# EAGLE schematic detect-UHF (EAGLE 9.2.2)
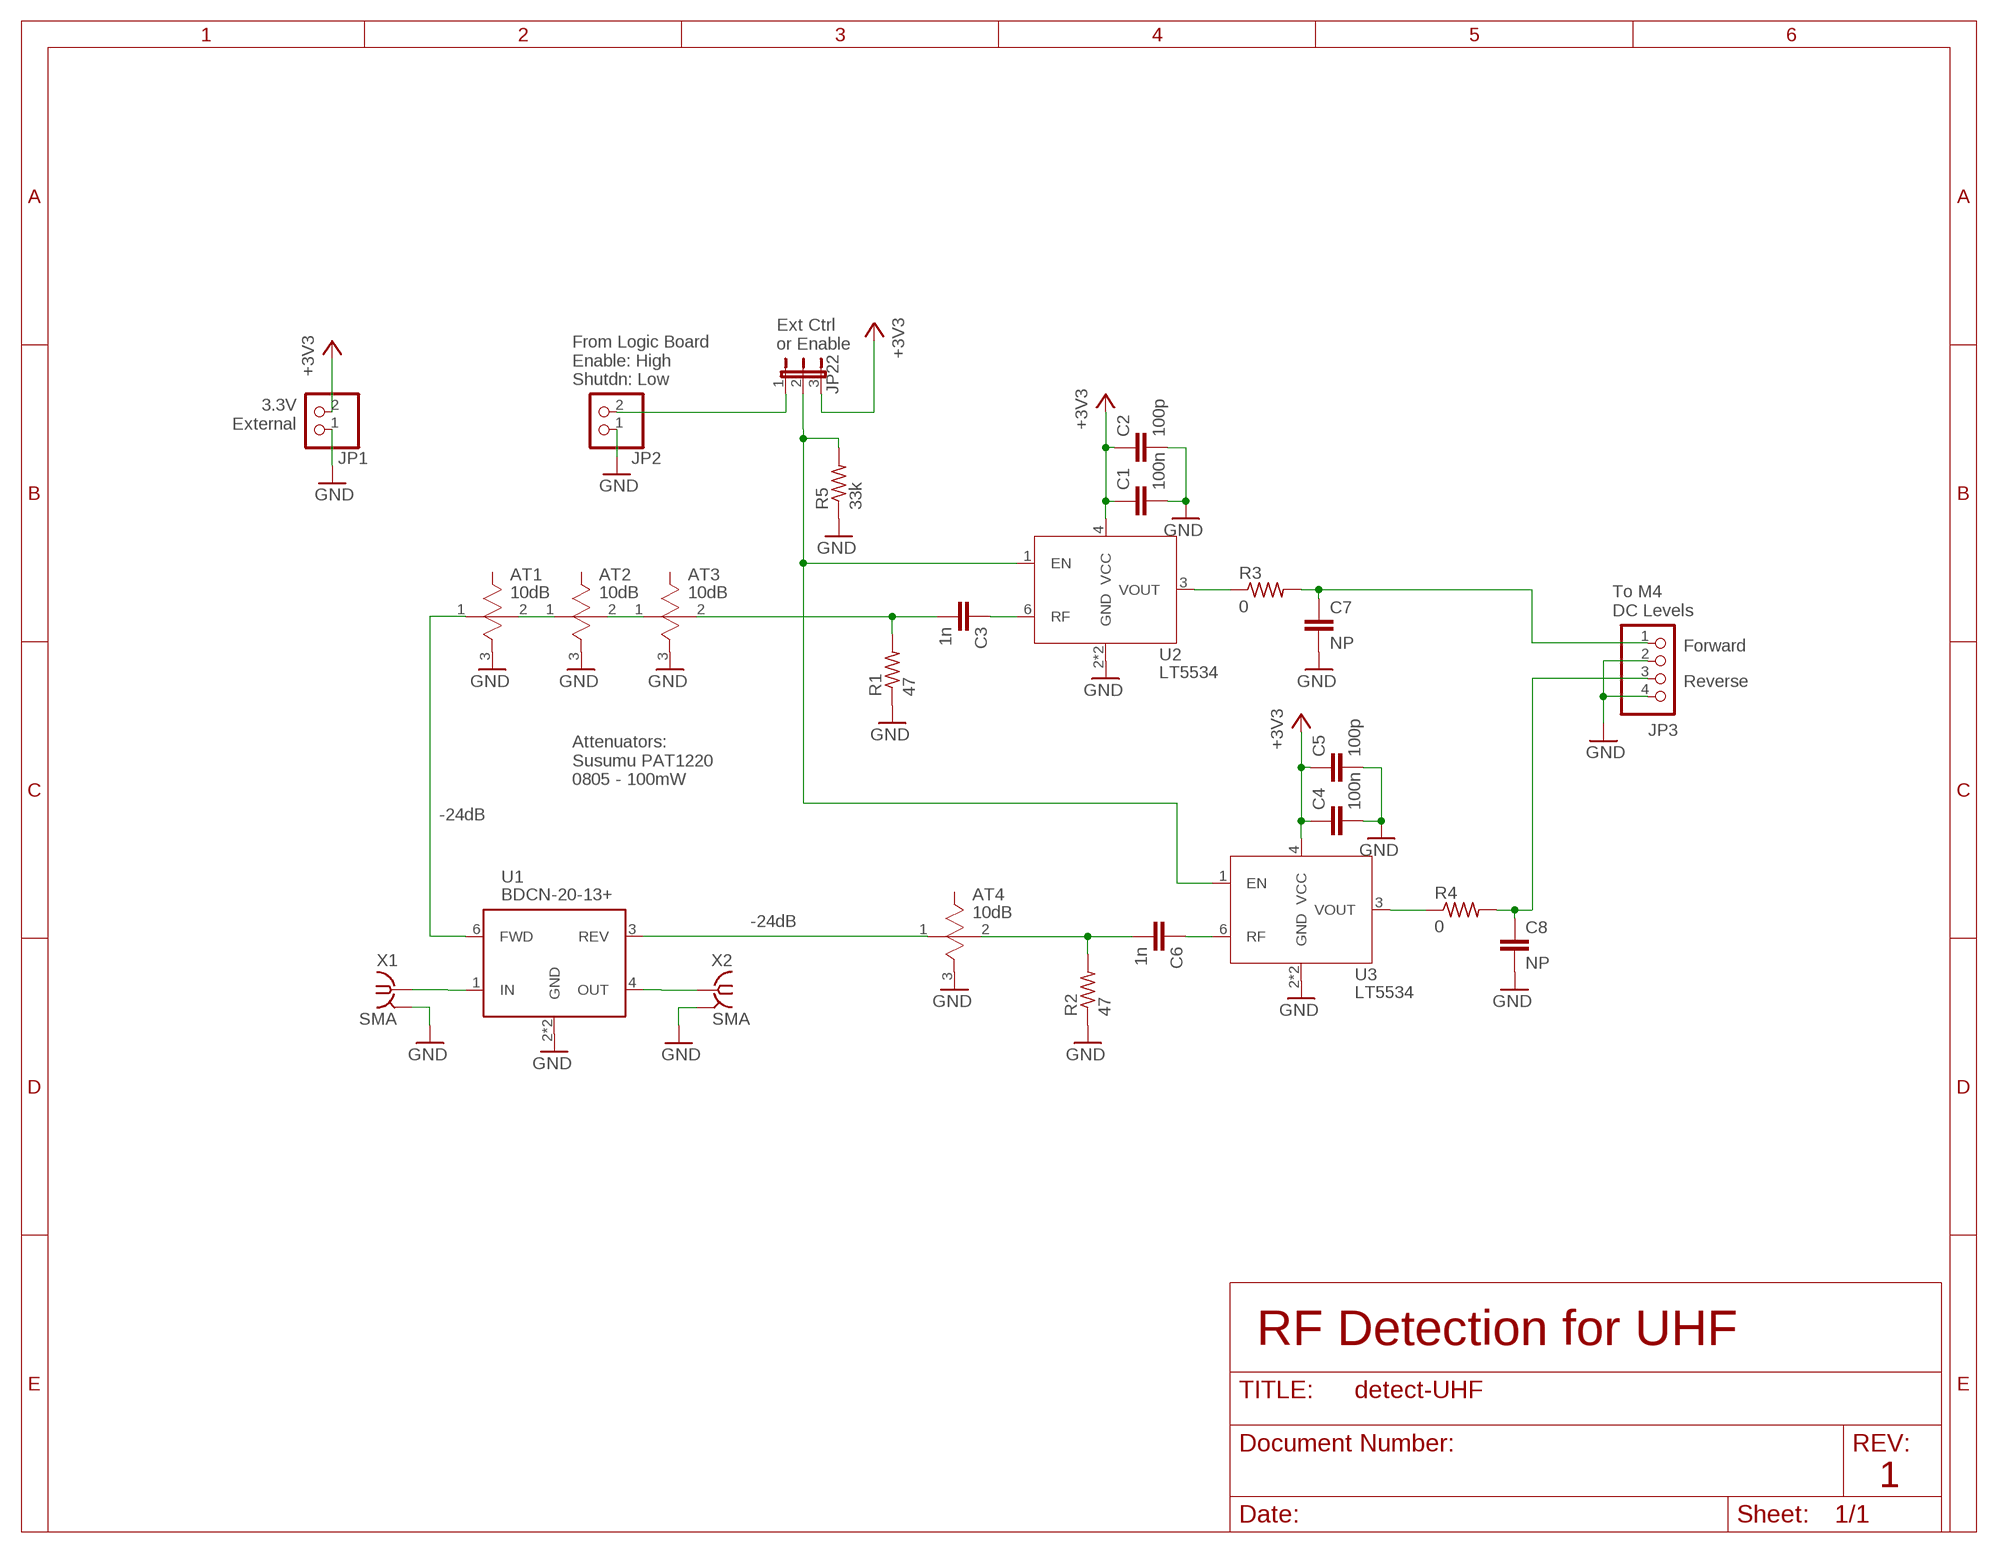
[diagram p0: schematic, sheet 1]

## Parts
AT1  10dB  PAT1220  [PAT1220]
AT2  10dB  PAT1220  [PAT1220]
AT3  10dB  PAT1220  [PAT1220]
AT4  10dB  PAT1220  [PAT1220]
C1  100n  C-EU0603-B-NOSILK  [.0603-B-NOSILK]
C2  100p  C-EU0603-B-NOSILK  [.0603-B-NOSILK]
C3  1n  C-EU0402-B-NOSILK  [.0402-B-NOSILK]
C4  100n  C-EU0603-B-NOSILK  [.0603-B-NOSILK]
C5  100p  C-EU0603-B-NOSILK  [.0603-B-NOSILK]
C6  1n  C-EU0402-B-NOSILK  [.0402-B-NOSILK]
C7  NP  C-EU0603-B-NOSILK  [.0603-B-NOSILK]
C8  NP  C-EU0603-B-NOSILK  [.0603-B-NOSILK]
JP1  PINHD-1X2  [1X02]
JP2  PINHD-1X2  [1X02]
JP3  PINHD-1X4  [1X04]
JP22  JP2E  [JP2]
R1  47  R-US_0402-B-NOSILK  [.0402-B-NOSILK]
R2  47  R-US_0402-B-NOSILK  [.0402-B-NOSILK]
R3  0  R-US_0603-B-NOSILK  [.0603-B-NOSILK]
R4  0  R-US_0603-B-NOSILK  [.0603-B-NOSILK]
R5  33k  R-US_0402-B-NOSILK  [.0402-B-NOSILK]
U1  BDCN-20-13+  [BDCN-20-13+]
U2  LT5534  [SC70]
U3  LT5534  [SC70]
X1  SMA  SMA-142-0701-801/806  [J502-ND-142-0701-801/806]
X2  SMA  SMA-142-0701-801/806  [J502-ND-142-0701-801/806]

## Nets
+3V3: C1.1 C2.1 C4.1 C5.1 JP1.2 JP22.3 U2.4(VCC) U3.4(VCC)
GND: AT1.3(GND) AT2.3(GND) AT3.3(GND) AT4.3(GND) C1.2 C2.2 C4.2 C5.2 C7.2 C8.2 JP1.1 JP2.1 JP3.2 JP3.4 R1.1 R2.1 R5.1 U1.2(GND) U1.5(GND) U2.2(GND) U2.5(GND) U3.2(GND) U3.5(GND) X1.G@1 X1.G@2 X1.G@3 X1.G@4 X2.G@1 X2.G@2 X2.G@3 X2.G@4
N$1: U1.4(OUT) X2.1
N$2: AT1.1 U1.6(FWD)
N$3: C3.1 U2.6(RF)
N$4: AT3.2 C3.2 R1.2
N$5: JP22.2 R5.2 U2.1(EN) U3.1(EN)
N$6: JP2.2 JP22.1
N$7: AT1.2 AT2.1
N$8: C6.1 U3.6(RF)
N$9: AT4.2 C6.2 R2.2
N$10: AT2.2 AT3.1
N$11: C7.1 JP3.1 R3.2
N$12: C8.1 JP3.3 R4.2
N$13: AT4.1 U1.3(REV)
N$14: R3.1 U2.3(VOUT)
N$15: R4.1 U3.3(VOUT)
N$39: U1.1(IN) X1.1

## Notes on the sheet
- Ext Ctrl
  or Enable
- From Logic Board
  Enable: High
  Shutdn: Low
- 3.3V
  External
- To M4
  DC Levels
- Forward
- Reverse
- Attenuators:
  Susumu PAT1220
  0805 - 100mW
- -24dB
- -24dB
- RF Detection for UHF
- 1

## Library data of the parts
AT1-AT4 = AT-Susumu-PAT-attenuator:PAT1220: Chip Attenuator 0805 size (2012 metric) 100 mW Source: Datasheet <https://www.susumu.co.jp/common/pdf/n_catalog_partition16_en.pdf>
C1-C8 = oresat-rcl:C-EU: CAPACITOR, European symbol
JP1 JP2 = pinhead:PINHD-1X2: PIN HEADER
JP3 = pinhead:PINHD-1X4: PIN HEADER
JP22 = jumper:JP2E: JUMPER
R1-R5 = oresat-rcl:R-US_: RESISTOR, American symbol
U1 = U-MiniCirc-BDCN-20-13+-coupler:BDCN-20-13+: Bi-Directional Coupler Band: 360 to 1000 MHz Coupling: 24 to 17.5 dB Source: Datasheet <https://www.minicircuits.com/pdfs/BDCN-20-13+.pdf>
U2 U3 = U-Linear-LT5534-RF-power-detector:LT5534: RF Power Detector Frequency Range: 50 MHz to 3 GHz Linear Dynamic Range: 60 dB Source: Datasheet <https://www.analog.com/media/en/technical-documentation/data-sheets/5534fc.pdf>
X1 X2 = con-coax:SMA-: SMA 50 Ohm End Launch Jack Receptacle - Round Contact Johnson Components Source: www.johnsoncomponents.com .. J502-ND.pdf; MF: JOHNSON COMPONENTS; MPN: 142-0701-801; OC_FARNELL: 1608592; OC_NEWARK: 90F2624